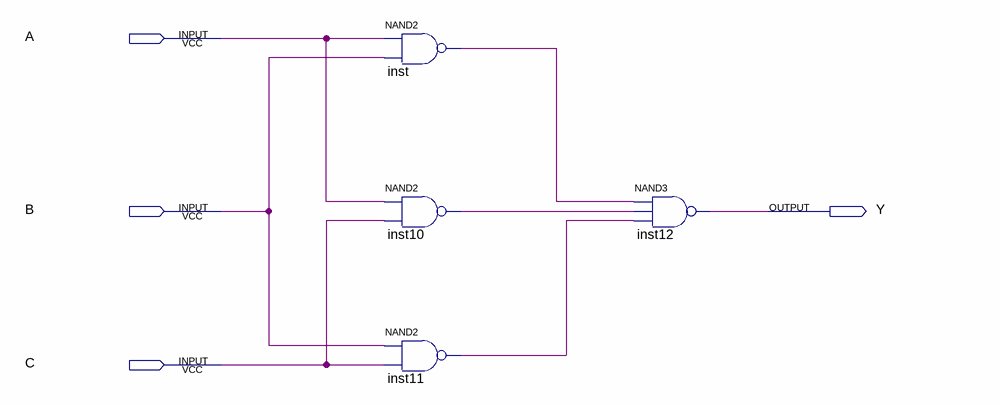
[diagram p0: schematic sheet]
// Quartus schematic srbj.bdf as structural Verilog: 4 symbols, 4 pins
module srbj (
  input  A,
  input  B,
  input  C,
  output Y
);

  wire inst10_out, inst11_out, inst_out;

  nand inst (inst_out, A, B);
  nand inst10 (inst10_out, A, C);
  nand inst11 (inst11_out, B, C);
  nand inst12 (Y, inst_out, inst10_out, inst11_out);
endmodule
